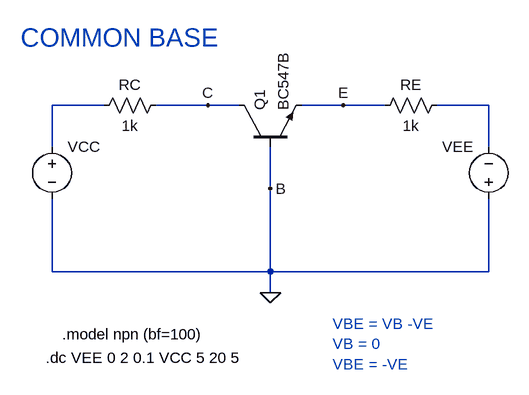
[diagram p0: schematic Common_Base .asc]
Common_Base .asc, the LTspice schematic file:
Version 4
SHEET 1 880 680
WIRE -80 96 -160 96
WIRE 80 96 0 96
WIRE 128 96 80 96
WIRE 288 96 224 96
WIRE 352 96 288 96
WIRE 512 96 432 96
WIRE -160 160 -160 96
WIRE 512 160 512 96
WIRE 176 224 176 160
WIRE -160 352 -160 240
WIRE 176 352 176 224
WIRE 176 352 -160 352
WIRE 512 352 512 240
WIRE 512 352 176 352
WIRE 176 384 176 352
FLAG 176 384 0
FLAG 80 96 C
FLAG 288 96 E
FLAG 176 224 B
SYMBOL res 448 80 R90
WINDOW 0 0 56 VBottom 2
WINDOW 3 32 56 VTop 2
SYMATTR InstName RE
SYMATTR Value 1k
SYMBOL res 16 80 R90
WINDOW 0 0 56 VBottom 2
WINDOW 3 32 56 VTop 2
SYMATTR InstName RC
SYMATTR Value 1k
SYMBOL voltage -160 144 R0
SYMATTR InstName VCC
SYMATTR Value ""
SYMBOL voltage 512 256 R180
WINDOW 0 24 96 Left 2
WINDOW 3 24 16 Left 2
SYMATTR InstName VEE
SYMATTR Value ""
SYMBOL npn 128 160 R270
SYMATTR InstName Q1
SYMATTR Value BC547B
TEXT -144 448 Left 2 !.model npn (bf=100)
TEXT -170 484 Left 2 !.dc VEE 0 2 0.1 VCC 5 20 5
TEXT 272 432 Left 2 ;VBE = VB -VE\nVB = 0\nVBE = -VE
TEXT -208 -8 Left 4 ;COMMON BASE

The netlist it stands for:
* Common_Base .asc
RE N002 E 1k
RC C N001 1k
VCC N001 0
VEE 0 N002
Q1 C 0 E 0 BC547B
.model NPN NPN
.model PNP PNP
.lib standard.bjt
.model npn (bf=100)
.dc VEE 0 2 0.1 VCC 5 20 5
* VBE = VB -VE
* VB = 0
* VBE = -VE
* COMMON BASE
.backanno
.end